# Altium project teclado.PrjPcb (part 2 of 3)
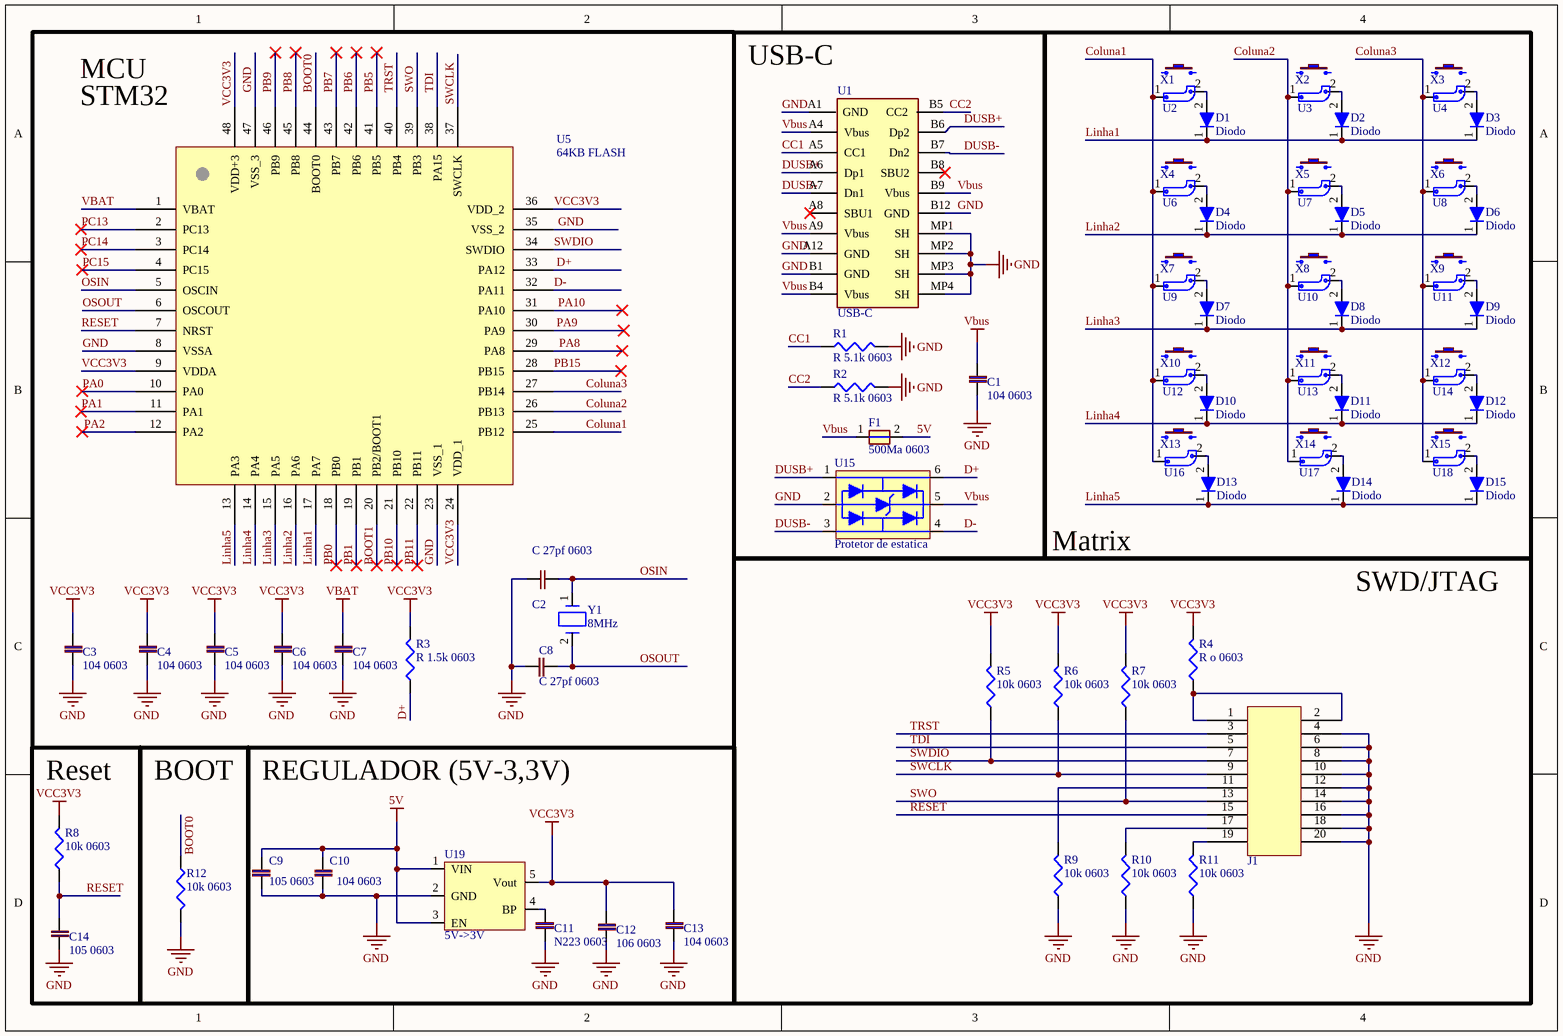
[diagram p1: SqTeclado.SchDoc]

## Sheet SqTeclado.SchDoc (continued)
### Library data of the parts
C1 C3-C7 C10 C13 = CC0603KRX7R7BB104: 16V 100nF X7R ±10% 0603 Multilayer Ceramic Capacitors MLCC - SMD/SMT ROHS; Manufacturer: Yageo Group; Insulation Resistance: 100GΩ; Supplier: DigiKey; Supplier Part Number: 311-1088-1-ND; Manufacturer Part Number: CC0603KRX7R7BB104; RoHS: Compliant; Category: Ceramic Capacitors; Stock: 6931735; Pricing: 1=0,08, 10=0,008, 50=0,0076, 100=0,0072, 500=0,00602 (USD); Value: 100nF; Case/Package: 0603; Case Code (Imperial): 0603; Case Code (Metric): 1608; China RoHS: Compliant; Composition: Ceramic; Depth: 800µm; Dielectric: X7R; Dielectric Material: Ceramic; Halogen Free: Halogen Free; Height: 800µm; Lead Free: Lead Free; Length: 1.6mm; Lifecycle Status: Production; Material: Ceramic; Max Operating Temperature: 125°C; Min Operating Temperature: -55°C; Mounting Technology: Surface Mount; Pins: 2; Number of Terminals: 2; Radiation Hardening: No; REACH SVHC: Yes; Schedule B: 8532240020, 8532240020|8532240020, 8532240020|8532240020|8532240020, 8532240020|8532240020|8532240020|8532240020; Termination: SMD/SMT; Thickness: 889µm; Tolerance: 10%; Voltage: 16V; Voltage Rating: 16V; Voltage Rating (DC): 16V; Width: 800µm; ComponentLink1URL: https://datasheet.octopart.com:443/CC0603KRX7R7BB104-Yageo-datasheet-177165144.pdf?src-supplier=IHS; ComponentLink1Description: https://datasheet.octopart.com:443/CC0603KRX7R7BB104-Yageo-datasheet-177165144.pdf?src-supplier=IHS; ComponentLink2URL: https://datasheet.octopart.com:443/CC0603KRX7R7BB104-Yageo-datasheet-82288757.pdf?src-supplier=Upverter; ComponentLink2Description: https://datasheet.octopart.com:443/CC0603KRX7R7BB104-Yageo-datasheet-82288757.pdf?src-supplier=Upverter; ComponentLink3URL: https://datasheet.octopart.com:443/CC0603KRX7R7BB104-Yageo-datasheet-182050803.pdf?src-supplier=Newark; ComponentLink3Description: https://datasheet.octopart.com:443/CC0603KRX7R7BB104-Yageo-datasheet-182050803.pdf?src-supplier=Newark; ComponentLink4URL: https://datasheet.octopart.com:443/CC0603KRX7R7BB104-Yageo-datasheet-181968638.pdf?src-supplier=Newark; ComponentLink4Description: https://datasheet.octopart.com:443/CC0603KRX7R7BB104-Yageo-datasheet-181968638.pdf?src-supplier=Newark; ComponentLink5URL: https://datasheet.octopart.com:443/CC0603KRX7R7BB104-Phycomp-datasheet-499490.pdf?src-supplier=Newark; ComponentLink5Description: https://datasheet.octopart.com:443/CC0603KRX7R7BB104-Phycomp-datasheet-499490.pdf?src-supplier=Newark; ComponentLink6URL: https://datasheet.octopart.com:443/CC0603KRX7R7BB104-Yageo-datasheet-62336348.pdf?src-supplier=Newark; ComponentLink6Description: https://datasheet.octopart.com:443/CC0603KRX7R7BB104-Yageo-datasheet-62336348.pdf?src-supplier=Newark; ComponentLink7URL: https://datasheet.octopart.com:443/CC0603KRX7R7BB104-Yageo-datasheet-15895757.pdf?src-supplier=Newark; ComponentLink7Description: https://datasheet.octopart.com:443/CC0603KRX7R7BB104-Yageo-datasheet-15895757.pdf?src-supplier=Newark; ComponentLink8URL: https://datasheet.octopart.com/CC0603KRX7R7BB104-Yageo-datasheet-10883670.pdf; ComponentLink8Description: https://datasheet.octopart.com/CC0603KRX7R7BB104-Yageo-datasheet-10883670.pdf; ComponentLink9URL: https://datasheet.octopart.com/CC0603KRX7R7BB104-Yageo-datasheet-12526321.pdf; ComponentLink9Description: https://datasheet.octopart.com/CC0603KRX7R7BB104-Yageo-datasheet-12526321.pdf; ComponentLink10URL: https://datasheet.octopart.com:443/CC0603KRX7R7BB104-Yageo-datasheet-151948686.pdf?src-supplier=Farnell; ComponentLink10Description: https://datasheet.octopart.com:443/CC0603KRX7R7BB104-Yageo-datasheet-151948686.pdf?src-supplier=Farnell; ComponentLink11URL: https://datasheet.octopart.com:443/CC0603KRX7R7BB104-Phycomp-datasheet-500777.pdf?src-supplier=Farnell; ComponentLink11Description: https://datasheet.octopart.com:443/CC0603KRX7R7BB104-Phycomp-datasheet-500777.pdf?src-supplier=Farnell; ComponentLink12URL: https://datasheet.octopart.com:443/CC0603KRX7R7BB104-Phycomp-datasheet-519481.pdf?src-supplier=element14; ComponentLink12Description: https://datasheet.octopart.com:443/CC0603KRX7R7BB104-Phycomp-datasheet-519481.pdf?src-supplier=element14; ComponentLink13URL: https://datasheet.octopart.com:443/CC0603KRX7R7BB104-Yageo-datasheet-8701427.pdf?src-supplier=element14; ComponentLink13Description: https://datasheet.octopart.com:443/CC0603KRX7R7BB104-Yageo-datasheet-8701427.pdf?src-supplier=element14; ComponentLink14URL: https://datasheet.octopart.com:443/CC0603KRX7R7BB104-Yageo-datasheet-5301394.pdf?src-supplier=element14; ComponentLink14Description: https://datasheet.octopart.com:443/CC0603KRX7R7BB104-Yageo-datasheet-5301394.pdf?src-supplier=element14; ComponentLink15URL: https://datasheet.octopart.com:443/CC0603KRX7R7BB104-Yageo-datasheet-166511530.pdf?src-supplier=Future+Electronics; ComponentLink15Description: https://datasheet.octopart.com:443/CC0603KRX7R7BB104-Yageo-datasheet-166511530.pdf?src-supplier=Future+Electronics; ComponentLink16URL: https://datasheet.octopart.com:443/CC0603KRX7R7BB104-Yageo-datasheet-137700082.pdf?src-supplier=Future+Electronics; ComponentLink16Description: https://datasheet.octopart.com:443/CC0603KRX7R7BB104-Yageo-datasheet-137700082.pdf?src-supplier=Future+Electronics; ComponentLink17URL: https://datasheet.octopart.com:443/CC0603KRX7R7BB104-Yageo-datasheet-137700084.pdf?src-supplier=Future+Electronics; ComponentLink17Description: https://datasheet.octopart.com:443/CC0603KRX7R7BB104-Yageo-datasheet-137700084.pdf?src-supplier=Future+Electronics; ComponentLink18URL: https://datasheet.octopart.com:443/CC0603KRX7R7BB104-Yageo-datasheet-27626582.pdf?src-supplier=Future+Electronics; ComponentLink18Description: https://datasheet.octopart.com:443/CC0603KRX7R7BB104-Yageo-datasheet-27626582.pdf?src-supplier=Future+Electronics; ComponentLink19URL: https://datasheet.octopart.com:443/CC0603KRX7R7BB104-Yageo-datasheet-10911834.pdf?src-supplier=Future+Electronics; ComponentLink19Description: https://datasheet.octopart.com:443/CC0603KRX7R7BB104-Yageo-datasheet-10911834.pdf?src-supplier=Future+Electronics; ComponentLink20URL: https://datasheet.octopart.com:443/CC0603KRX7R7BB104-Yageo-datasheet-8324442.pdf?src-supplier=Future+Electronics; ComponentLink20Description: https://datasheet.octopart.com:443/CC0603KRX7R7BB104-Yageo-datasheet-8324442.pdf?src-supplier=Future+Electronics; ComponentLink21URL: https://datasheet.octopart.com:443/CC0603KRX7R7BB104-Yageo-Group-datasheet-165992755.pdf?src-supplier=ODG+(Origin+Data+Global); ComponentLink21Description: https://datasheet.octopart.com:443/CC0603KRX7R7BB104-Yageo-Group-datasheet-165992755.pdf?src-supplier=ODG+(Origin+Data+Global); ComponentLink22URL: https://datasheet.octopart.com:443/CC0603KRX7R7BB104-Yageo-datasheet-140260305.pdf?src-supplier=SOS+electronic; ComponentLink22Description: https://datasheet.octopart.com:443/CC0603KRX7R7BB104-Yageo-datasheet-140260305.pdf?src-supplier=SOS+electronic; ComponentLink23URL: https://datasheet.octopart.com:443/CC0603KRX7R7BB104-Yageo-datasheet-178018956.pdf?src-supplier=Burklin+Elektronik; ComponentLink23Description: https://datasheet.octopart.com:443/CC0603KRX7R7BB104-Yageo-datasheet-178018956.pdf?src-supplier=Burklin+Elektronik; ComponentLink24URL: https://datasheet.octopart.com:443/CC0603KRX7R7BB104-Yageo-datasheet-17600895.pdf?src-supplier=TME; ComponentLink24Description: https://datasheet.octopart.com:443/CC0603KRX7R7BB104-Yageo-datasheet-17600895.pdf?src-supplier=TME; ComponentLink25URL: https://datasheet.octopart.com:443/CC0603KRX7R7BB104-Yageo-datasheet-118396.pdf?src-supplier=DigiKey; ComponentLink25Description: https://datasheet.octopart.com:443/CC0603KRX7R7BB104-Yageo-datasheet-118396.pdf?src-supplier=DigiKey; ComponentLink26URL: http://sigma.octopart.com:80/rohs_statement/Surface-Mount-Ceramic-Multilayer-Capacitors%3B-General-Purpose-%26-High-Capacitance-Class-2%2C-X7R-Yageo-family-124.pdf?src-supplier=Compliance+Statements; ComponentLink26Description: http://sigma.octopart.com:80/rohs_statement/Surface-Mount-Ceramic-Multilayer-Capacitors%3B-General-Purpose-%26-High-Capacitance-Class-2%2C-X7R-Yageo-family-124.pdf?src-supplier=Compliance+Statements; ComponentLink27URL: http://sigma.octopart.com:80/reach_statement/Surface-Mount-Ceramic-Multilayer-Capacitors%3B-General-Purpose-%26-High-Capacitance-Class-2%2C-X7R-Yageo-family-125.pdf?src-supplier=Compliance+Statements; ComponentLink27Description: http://sigma.octopart.com:80/reach_statement/Surface-Mount-Ceramic-Multilayer-Capacitors%3B-General-Purpose-%26-High-Capacitance-Class-2%2C-X7R-Yageo-family-125.pdf?src-supplier=Compliance+Statements; ComponentLink28URL: http://sigma.octopart.com:80/conflict_mineral_statement/Yageo-company-3.pdf?src-supplier=Compliance+Statements; ComponentLink28Description: http://sigma.octopart.com:80/conflict_mineral_statement/Yageo-company-3.pdf?src-supplier=Compliance+Statements; ComponentLink29URL: http://sigma.octopart.com:80/rohs_statement/Yageo-company-2.pdf?src-supplier=Compliance+Statements; ComponentLink29Description: http://sigma.octopart.com:80/rohs_statement/Yageo-company-2.pdf?src-supplier=Compliance+Statements
C2 C8 = CC0603FRNPO9BN270: 0603 27 pF 50 V ±1 % Tolerance NP0 SMT Multilayer Ceramic Capacitor; Manufacturer: Yageo Group; Dielectric: C0G; Insulation Resistance: 10GΩ; Tolerance: 1%; Voltage: 50V; Supplier: DigiKey; Supplier Part Number: 311-3892-1-ND; Manufacturer Part Number: CC0603FRNPO9BN270; RoHS: Compliant; Category: Ceramic Capacitors; Stock: 26604; Pricing: 1=0,15, 10=0,086, 50=0,0606, 100=0,0527, 500=0,03964, 1000=0,03562 (USD); Value: 27pF; Case/Package: 0603; Case Code (Imperial): 0603; Case Code (Metric): 1608; China RoHS: Compliant; Composition: Ceramic; Depth: 800µm; Dielectric Material: Ceramic; Halogen Free: Halogen Free; Height: 800µm; Lead Free: Lead Free; Length: 1.6mm; Lifecycle Status: Production; Max Operating Temperature: 125°C; Min Operating Temperature: -55°C; Mounting Technology: Surface Mount; Number of Terminals: 2; Packaging: Tape and Reel; Radiation Hardening: No; REACH SVHC: Yes; Schedule B: 8532240020, 8532240020|8532240020|8532240020|8532240020|8532240020; Termination: SMD/SMT; Thickness: 889µm; Voltage Rating: 50V; Voltage Rating (DC): 50V; Width: 800µm; ComponentLink1URL: https://datasheet.octopart.com:443/CC0603FRNPO9BN270-Yageo-datasheet-182140217.pdf?src-supplier=IHS; ComponentLink1Description: https://datasheet.octopart.com:443/CC0603FRNPO9BN270-Yageo-datasheet-182140217.pdf?src-supplier=IHS; ComponentLink2URL: https://datasheet.octopart.com:443/CC0603FRNPO9BN270-Yageo-datasheet-151948684.pdf?src-supplier=JRH+Electronics; ComponentLink2Description: https://datasheet.octopart.com:443/CC0603FRNPO9BN270-Yageo-datasheet-151948684.pdf?src-supplier=JRH+Electronics; ComponentLink3URL: https://datasheet.octopart.com:443/CC0603FRNPO9BN270-Yageo-datasheet-181967889.pdf?src-supplier=Farnell; ComponentLink3Description: https://datasheet.octopart.com:443/CC0603FRNPO9BN270-Yageo-datasheet-181967889.pdf?src-supplier=Farnell; ComponentLink4URL: https://datasheet.octopart.com:443/CC0603FRNPO9BN270-Yageo-datasheet-137875056.pdf?src-supplier=Future+Electronics; ComponentLink4Description: https://datasheet.octopart.com:443/CC0603FRNPO9BN270-Yageo-datasheet-137875056.pdf?src-supplier=Future+Electronics; ComponentLink5URL: https://datasheet.octopart.com:443/CC0603FRNPO9BN270-Yageo-datasheet-136957424.pdf?src-supplier=Future+Electronics; ComponentLink5Description: https://datasheet.octopart.com:443/CC0603FRNPO9BN270-Yageo-datasheet-136957424.pdf?src-supplier=Future+Electronics; ComponentLink6URL: https://datasheet.octopart.com:443/CC0603FRNPO9BN270-Yageo-datasheet-137700082.pdf?src-supplier=Future+Electronics; ComponentLink6Description: https://datasheet.octopart.com:443/CC0603FRNPO9BN270-Yageo-datasheet-137700082.pdf?src-supplier=Future+Electronics; ComponentLink7URL: https://datasheet.octopart.com:443/CC0603FRNPO9BN270-Yageo-datasheet-78855684.pdf?src-supplier=Future+Electronics; ComponentLink7Description: https://datasheet.octopart.com:443/CC0603FRNPO9BN270-Yageo-datasheet-78855684.pdf?src-supplier=Future+Electronics; ComponentLink8URL: https://datasheet.octopart.com:443/CC0603FRNPO9BN270-Yageo-datasheet-16730043.pdf?src-supplier=Future+Electronics; ComponentLink8Description: https://datasheet.octopart.com:443/CC0603FRNPO9BN270-Yageo-datasheet-16730043.pdf?src-supplier=Future+Electronics; ComponentLink9URL: https://datasheet.octopart.com:443/CC0603FRNPO9BN270-Yageo-datasheet-12589826.pdf?src-supplier=Future+Electronics; ComponentLink9Description: https://datasheet.octopart.com:443/CC0603FRNPO9BN270-Yageo-datasheet-12589826.pdf?src-supplier=Future+Electronics; ComponentLink10URL: https://datasheet.octopart.com:443/CC0603FRNPO9BN270-Yageo-datasheet-10406438.pdf?src-supplier=Future+Electronics; ComponentLink10Description: https://datasheet.octopart.com:443/CC0603FRNPO9BN270-Yageo-datasheet-10406438.pdf?src-supplier=Future+Electronics; ComponentLink11URL: https://datasheet.octopart.com:443/CC0603FRNPO9BN270-Yageo-datasheet-8817079.pdf?src-supplier=Future+Electronics; ComponentLink11Description: https://datasheet.octopart.com:443/CC0603FRNPO9BN270-Yageo-datasheet-8817079.pdf?src-supplier=Future+Electronics; ComponentLink12URL: https://datasheet.octopart.com:443/CC0603FRNPO9BN270-Yageo-datasheet-8324240.pdf?src-supplier=Future+Electronics; ComponentLink12Description: https://datasheet.octopart.com:443/CC0603FRNPO9BN270-Yageo-datasheet-8324240.pdf?src-supplier=Future+Electronics; ComponentLink13URL: https://datasheet.octopart.com:443/CC0603FRNPO9BN270-Yageo-datasheet-504625.pdf?src-supplier=Future+Electronics; ComponentLink13Description: https://datasheet.octopart.com:443/CC0603FRNPO9BN270-Yageo-datasheet-504625.pdf?src-supplier=Future+Electronics; ComponentLink14URL: https://datasheet.octopart.com:443/CC0603FRNPO9BN270-Yageo-datasheet-5321569.pdf?src-supplier=Future+Electronics; ComponentLink14Description: https://datasheet.octopart.com:443/CC0603FRNPO9BN270-Yageo-datasheet-5321569.pdf?src-supplier=Future+Electronics; ComponentLink15URL: http://sigma.octopart.com:80/conflict_mineral_statement/Yageo-company-3.pdf?src-supplier=Compliance+Statements; ComponentLink15Description: http://sigma.octopart.com:80/conflict_mineral_statement/Yageo-company-3.pdf?src-supplier=Compliance+Statements; ComponentLink16URL: http://sigma.octopart.com:80/rohs_statement/Yageo-company-2.pdf?src-supplier=Compliance+Statements; ComponentLink16Description: http://sigma.octopart.com:80/rohs_statement/Yageo-company-2.pdf?src-supplier=Compliance+Statements
C9 C14 = CL10B105KP8NNNC: 10V 1uF X7R ±10% 0603 Multilayer Ceramic Capacitors MLCC - SMD/SMT ROHS; Manufacturer: Samsung Electro-Mechanics; Value: 1µF; Supplier: DigiKey; Supplier Part Number: 1276-1946-1-ND; Manufacturer Part Number: CL10B105KP8NNNC; RoHS: Compliant; Category: Ceramic Capacitors; Stock: 4700118; Pricing: 1=0,08, 10=0,005 (USD); Case/Package: 0603; Case Code (Imperial): 0603; Case Code (Metric): 1608; China RoHS: Compliant; Contact Plating: Tin; Depth: 800µm; Dielectric: X7R; Dielectric Material: Ceramic; Height: 900µm; Lead Free: Lead Free; Length: 1.6mm; Lifecycle Status: Production; Material: Ceramic; Max Operating Temperature: 125°C; Min Operating Temperature: -55°C; Mounting Technology: Surface Mount; Number of Terminals: 2; Radiation Hardening: No; REACH SVHC: Yes; Schedule B: 8532240020, 8532240020|8532240020, 8532240020|8532240020|8532240020, 8532240020|8532240020|8532240020|8532240020; Thickness: 889µm; Tolerance: 10%; Voltage Rating: 10V; Voltage Rating (DC): 10V; Width: 800µm; ComponentLink1URL: https://datasheet.octopart.com:443/CL10B105KP8NNNC-Samsung-Electro-Mechanics-datasheet-136482318.pdf?src-supplier=IHS; ComponentLink1Description: https://datasheet.octopart.com:443/CL10B105KP8NNNC-Samsung-Electro-Mechanics-datasheet-136482318.pdf?src-supplier=IHS; ComponentLink2URL: https://datasheet.octopart.com:443/CL10B105KP8NNNC-Samsung-Electro-Mechanics-datasheet-116051279.pdf?src-supplier=Future+Electronics; ComponentLink2Description: https://datasheet.octopart.com:443/CL10B105KP8NNNC-Samsung-Electro-Mechanics-datasheet-116051279.pdf?src-supplier=Future+Electronics; ComponentLink3URL: https://datasheet.octopart.com:443/CL10B105KP8NNNC-Samsung-Electro-Mechanics-datasheet-81461854.pdf?src-supplier=Future+Electronics; ComponentLink3Description: https://datasheet.octopart.com:443/CL10B105KP8NNNC-Samsung-Electro-Mechanics-datasheet-81461854.pdf?src-supplier=Future+Electronics; ComponentLink4URL: https://datasheet.octopart.com:443/CL10B105KP8NNNC-Samsung-datasheet-13325309.pdf?src-supplier=Future+Electronics; ComponentLink4Description: https://datasheet.octopart.com:443/CL10B105KP8NNNC-Samsung-datasheet-13325309.pdf?src-supplier=Future+Electronics; ComponentLink5URL: https://datasheet.octopart.com:443/CL10B105KP8NNNC-Samsung-datasheet-26669024.pdf?src-supplier=Future+Electronics; ComponentLink5Description: https://datasheet.octopart.com:443/CL10B105KP8NNNC-Samsung-datasheet-26669024.pdf?src-supplier=Future+Electronics; ComponentLink6URL: https://datasheet.octopart.com:443/CL10B105KP8NNNC-Samsung-Electro-Mechanics-datasheet-149136800.pdf?src-supplier=Future+Electronics; ComponentLink6Description: https://datasheet.octopart.com:443/CL10B105KP8NNNC-Samsung-Electro-Mechanics-datasheet-149136800.pdf?src-supplier=Future+Electronics; ComponentLink7URL: https://datasheet.octopart.com:443/CL10B105KP8NNNC-Samsung-datasheet-37081328.pdf?src-supplier=Future+Electronics; ComponentLink7Description: https://datasheet.octopart.com:443/CL10B105KP8NNNC-Samsung-datasheet-37081328.pdf?src-supplier=Future+Electronics; ComponentLink8URL: https://datasheet.octopart.com/CL10B105KP8NNNC-Samsung-Electro-Mechanics-datasheet-97040617.pdf; ComponentLink8Description: https://datasheet.octopart.com/CL10B105KP8NNNC-Samsung-Electro-Mechanics-datasheet-97040617.pdf; ComponentLink9URL: https://datasheet.octopart.com/CL10B105KP8NNNC-Samsung-Electro-Mechanics-datasheet-8324245.pdf; ComponentLink9Description: https://datasheet.octopart.com/CL10B105KP8NNNC-Samsung-Electro-Mechanics-datasheet-8324245.pdf; ComponentLink10URL: https://datasheet.octopart.com:443/CL10B105KP8NNNC-Samsung-Electro-Mechanics-datasheet-11881110.pdf?src-supplier=Arrow+Electronics; ComponentLink10Description: https://datasheet.octopart.com:443/CL10B105KP8NNNC-Samsung-Electro-Mechanics-datasheet-11881110.pdf?src-supplier=Arrow+Electronics; ComponentLink11URL: https://datasheet.octopart.com:443/CL10B105KP8NNNC-Samsung-datasheet-59220082.pdf?src-supplier=TME; ComponentLink11Description: https://datasheet.octopart.com:443/CL10B105KP8NNNC-Samsung-datasheet-59220082.pdf?src-supplier=TME
C11 = CL10B223KB8WPNC: Ceramic Capacitor, Multilayer, Ceramic, 50V, 10% +Tol, 10% -Tol, X7R, +-15% TC, 22nF, Surface Mount, 0603 inch; Manufacturer: Samsung Electro-Mechanics; Supplier: DigiKey; Supplier Part Number: 1276-6534-1-ND; Manufacturer Part Number: CL10B223KB8WPNC; RoHS: Compliant; Category: Ceramic Capacitors; Stock: 843417; Pricing: 1=0,1, 10=0,041, 50=0,028, 100=0,024, 500=0,01736, 1000=0,01532 (USD); Value: 22nF; Case/Package: 0603; Case Code (Imperial): 0603; Case Code (Metric): 1608; China RoHS: Compliant; Dielectric Material: Ceramic; Features: Soft Termination; Height: 900µm; Length: 1.6002mm; Lifecycle Status: Production; Material: Ceramic; Max Operating Temperature: 125°C; Min Operating Temperature: -55°C; Mounting Technology: Surface Mount; Number of Terminals: 2; Packaging: Cut Tape (CT); Ratings: AEC-Q200; REACH SVHC: Yes; Thickness: 889µm; Tolerance: 10%; Voltage Rating: 50V; Voltage Rating (DC): 50V; Width: 787.4µm; ComponentLink1URL: https://datasheet.octopart.com:443/CL10B223KB8WPNC-Samsung-Electro-Mechanics-datasheet-176142735.pdf?src-supplier=Farnell; ComponentLink1Description: https://datasheet.octopart.com:443/CL10B223KB8WPNC-Samsung-Electro-Mechanics-datasheet-176142735.pdf?src-supplier=Farnell; ComponentLink2URL: https://datasheet.octopart.com:443/CL10B223KB8WPNC-Samsung-Electro-Mechanics-datasheet-140815180.pdf?src-supplier=Farnell; ComponentLink2Description: https://datasheet.octopart.com:443/CL10B223KB8WPNC-Samsung-Electro-Mechanics-datasheet-140815180.pdf?src-supplier=Farnell; ComponentLink3URL: https://datasheet.octopart.com:443/CL10B223KB8WPNC-Samsung-Electro-Mechanics-datasheet-141347181.pdf?src-supplier=Samsung+SCT; ComponentLink3Description: https://datasheet.octopart.com:443/CL10B223KB8WPNC-Samsung-Electro-Mechanics-datasheet-141347181.pdf?src-supplier=Samsung+SCT; ComponentLink4URL: https://datasheet.octopart.com:443/CL10B223KB8WPNC-Samsung-datasheet-8326407.pdf?src-supplier=TME; ComponentLink4Description: https://datasheet.octopart.com:443/CL10B223KB8WPNC-Samsung-datasheet-8326407.pdf?src-supplier=TME; ComponentLink5URL: https://datasheet.octopart.com:443/CL10B223KB8WPNC-Samsung-Electro-Mechanics-datasheet-149136823.pdf?src-supplier=Future+Electronics; ComponentLink5Description: https://datasheet.octopart.com:443/CL10B223KB8WPNC-Samsung-Electro-Mechanics-datasheet-149136823.pdf?src-supplier=Future+Electronics
C12 = LMK107BBJ106MALT: Multilayer Ceramic Capacitors (High dielectric type), 10V, 10 uF, ± 20 %, 0603, X5R, RoHS; Manufacturer: Taiyo Yuden; Value: 10µF; Tolerance: 20%; Supplier: DigiKey; Supplier Part Number: 587-3258-1-ND; Manufacturer Part Number: LMK107BBJ106MALT; RoHS: Compliant; Category: Ceramic Capacitors; Stock: 1593340; Pricing: 1=0,08, 10=0,046, 50=0,036, 100=0,0256, 500=0,0212, 1000=0,01928 (USD); Case/Package: 0603; Case Code (Imperial): 0603; Case Code (Metric): 1608; Composition: Ceramic; Depth: 800µm; Dielectric: X5R; Dielectric Material: Ceramic; Height: 800µm; Lead Free: Lead Free; Length: 1.6mm; Lifecycle Status: Production; Material: Ceramic; Max Operating Temperature: 85°C; Min Operating Temperature: -55°C; Mounting Technology: Surface Mount; Number of Terminals: 2; Radiation Hardening: No; REACH SVHC: Yes; Termination: SMD/SMT; Thickness: 889µm; Voltage: 10V; Voltage Rating: 10V; Voltage Rating (DC): 10V; Width: 800µm; ComponentLink1URL: https://datasheet.octopart.com:443/LMK107BBJ106MALT-Taiyo-Yuden-datasheet-182109547.pdf?src-supplier=IHS; ComponentLink1Description: https://datasheet.octopart.com:443/LMK107BBJ106MALT-Taiyo-Yuden-datasheet-182109547.pdf?src-supplier=IHS; ComponentLink2URL: https://datasheet.octopart.com:443/LMK107BBJ106MALT-Taiyo-Yuden-datasheet-151625811.pdf?src-supplier=element14+APAC; ComponentLink2Description: https://datasheet.octopart.com:443/LMK107BBJ106MALT-Taiyo-Yuden-datasheet-151625811.pdf?src-supplier=element14+APAC; ComponentLink3URL: https://datasheet.octopart.com:443/LMK107BBJ106MALT-Taiyo-Yuden-datasheet-21408036.pdf?src-supplier=element14+APAC; ComponentLink3Description: https://datasheet.octopart.com:443/LMK107BBJ106MALT-Taiyo-Yuden-datasheet-21408036.pdf?src-supplier=element14+APAC; ComponentLink4URL: https://datasheet.octopart.com:443/LMK107BBJ106MALT-Taiyo-Yuden-datasheet-41194858.pdf?src-supplier=Newark; ComponentLink4Description: https://datasheet.octopart.com:443/LMK107BBJ106MALT-Taiyo-Yuden-datasheet-41194858.pdf?src-supplier=Newark; ComponentLink5URL: https://datasheet.octopart.com:443/LMK107BBJ106MALT-Taiyo-Yuden-datasheet-8857305.pdf?src-supplier=Newark; ComponentLink5Description: https://datasheet.octopart.com:443/LMK107BBJ106MALT-Taiyo-Yuden-datasheet-8857305.pdf?src-supplier=Newark; ComponentLink6URL: https://datasheet.octopart.com:443/LMK107BBJ106MALT-Taiyo-Yuden-datasheet-8434558.pdf?src-supplier=Newark; ComponentLink6Description: https://datasheet.octopart.com:443/LMK107BBJ106MALT-Taiyo-Yuden-datasheet-8434558.pdf?src-supplier=Newark; ComponentLink7URL: https://datasheet.octopart.com:443/LMK107BBJ106MALT-Taiyo-Yuden-datasheet-154807907.pdf?src-supplier=Master+Electronics; ComponentLink7Description: https://datasheet.octopart.com:443/LMK107BBJ106MALT-Taiyo-Yuden-datasheet-154807907.pdf?src-supplier=Master+Electronics; ComponentLink8URL: https://datasheet.octopart.com:443/LMK107BBJ106MALT-Taiyo-Yuden-datasheet-140424376.pdf?src-supplier=Master+Electronics; ComponentLink8Description: https://datasheet.octopart.com:443/LMK107BBJ106MALT-Taiyo-Yuden-datasheet-140424376.pdf?src-supplier=Master+Electronics; ComponentLink9URL: https://datasheet.octopart.com:443/LMK107BBJ106MALT-Taiyo-Yuden-datasheet-10851928.pdf?src-supplier=Future+Electronics; ComponentLink9Description: https://datasheet.octopart.com:443/LMK107BBJ106MALT-Taiyo-Yuden-datasheet-10851928.pdf?src-supplier=Future+Electronics; ComponentLink10URL: https://datasheet.octopart.com:443/LMK107BBJ106MALT-Taiyo-Yuden-datasheet-100443364.pdf?src-supplier=Future+Electronics; ComponentLink10Description: https://datasheet.octopart.com:443/LMK107BBJ106MALT-Taiyo-Yuden-datasheet-100443364.pdf?src-supplier=Future+Electronics; ComponentLink11URL: https://datasheet.octopart.com:443/LMK107BBJ106MALT-Taiyo-Yuden-datasheet-99833423.pdf?src-supplier=Future+Electronics; ComponentLink11Description: https://datasheet.octopart.com:443/LMK107BBJ106MALT-Taiyo-Yuden-datasheet-99833423.pdf?src-supplier=Future+Electronics; ComponentLink12URL: https://datasheet.octopart.com:443/LMK107BBJ106MALT-Taiyo-Yuden-datasheet-99833418.pdf?src-supplier=Future+Electronics; ComponentLink12Description: https://datasheet.octopart.com:443/LMK107BBJ106MALT-Taiyo-Yuden-datasheet-99833418.pdf?src-supplier=Future+Electronics; ComponentLink13URL: https://datasheet.octopart.com:443/LMK107BBJ106MALT-Taiyo-Yuden-datasheet-138738940.pdf?src-supplier=Taiyo+Yuden+SCT; ComponentLink13Description: https://datasheet.octopart.com:443/LMK107BBJ106MALT-Taiyo-Yuden-datasheet-138738940.pdf?src-supplier=Taiyo+Yuden+SCT
D1-D15 = RB751V40T1G: Rectifier Diode Schottky 40V 0.03A 2-Pin SOD-323 T/R / DIODE SCHOTTKY 30V 30MA SOD323; Manufacturer: onsemi; Manufacturer Lifecycle Status: ACTIVE; Value: 2pF; Element Configuration: Single; Forward Voltage: 370mV; Max Forward Surge Current (Ifsm): 500mA; Max Junction Temperature (Tj): 150°C; Max Power Dissipation: 200mW; Max Reverse Leakage Current: 500nA; Number of Elements: 1; Peak Reverse Current: 300nA; Polarity: Standard; Supplier: DigiKey; Supplier Part Number: RB751V40T1GOSCT-ND; Manufacturer Part Number: RB751V40T1G; RoHS: Compliant; Category: Schottky Diodes; Stock: 326738; Pricing: 1=0,12, 10=0,08, 100=0,0663, 500=0,0482, 1000=0,04232 (USD); Average Rectified Current: 30mA; China RoHS: Compliant; Current Rating: 30mA; Forward Current: 30mA; Height: 1.1mm; Lead Free: Lead Free; Length: 1.7mm; Lifecycle Status: Production; Max Operating Temperature: 150°C; Max Output current: 30mA; Max Repetitive Reverse Voltage (Vrrm): 40V; Max Reverse Voltage (DC): 30V; Max Surge Current: 500mA; Min Operating Temperature: -55°C; Pins: 2; Number of Terminals: 2; Output Current: 30mA; Packaging: Tape and Reel; Peak Non-Repetitive Surge Current: 500mA; Power Dissipation: 200mW; Radiation Hardening: No; REACH SVHC: Yes; Reverse Standoff Voltage: 40V; Reverse Voltage: 30V; Schedule B: 8541100070, 8541100070|8541100070|8541100070|8541100070|8541100070; Voltage Rating (DC): 40V; Width: 1.25mm; ComponentLink1URL: https://datasheet.octopart.com:443/RB751V40T1G-ON-Semiconductor-datasheet-41194509.pdf?src-supplier=Newark; ComponentLink1Description: https://datasheet.octopart.com:443/RB751V40T1G-ON-Semiconductor-datasheet-41194509.pdf?src-supplier=Newark; ComponentLink2URL: https://datasheet.octopart.com:443/RB751V40T1G-onsemi-datasheet-181959519.pdf?src-supplier=Newark; ComponentLink2Description: https://datasheet.octopart.com:443/RB751V40T1G-onsemi-datasheet-181959519.pdf?src-supplier=Newark; ComponentLink3URL: https://datasheet.octopart.com:443/RB751V40T1G-onsemi-datasheet-180967452.pdf?src-supplier=IHS; ComponentLink3Description: https://datasheet.octopart.com:443/RB751V40T1G-onsemi-datasheet-180967452.pdf?src-supplier=IHS; ComponentLink4URL: https://datasheet.octopart.com:443/RB751V40T1G-ON-Semiconductor-datasheet-7840961.pdf?src-supplier=onsemi; ComponentLink4Description: https://datasheet.octopart.com:443/RB751V40T1G-ON-Semiconductor-datasheet-7840961.pdf?src-supplier=onsemi; ComponentLink5URL: https://sigma.octopart.com:443/138897946/technical_drawing/ON-Semiconductor-RB751V40T1G.pdf?src-supplier=Upverter; ComponentLink5Description: https://sigma.octopart.com:443/138897946/technical_drawing/ON-Semiconductor-RB751V40T1G.pdf?src-supplier=Upverter; ComponentLink6URL: https://datasheet.octopart.com:443/RB751V40T1G-onsemi-datasheet-189132549.pdf?src-supplier=Master+Electronics; ComponentLink6Description: https://datasheet.octopart.com:443/RB751V40T1G-onsemi-datasheet-189132549.pdf?src-supplier=Master+Electronics; ComponentLink7URL: https://datasheet.octopart.com:443/RB751V40T1G-ON-Semiconductor-datasheet-14053699.pdf?src-supplier=iiiC; ComponentLink7Description: https://datasheet.octopart.com:443/RB751V40T1G-ON-Semiconductor-datasheet-14053699.pdf?src-supplier=iiiC; ComponentLink8URL: http://sigma.octopart.com:80/150630996/rohs_statement/ON-Semiconductor-RB751V40T1G.pdf?src-supplier=Compliance+Statements; ComponentLink8Description: http://sigma.octopart.com:80/150630996/rohs_statement/ON-Semiconductor-RB751V40T1G.pdf?src-supplier=Compliance+Statements; Breakdown Voltage: 30V; Case/Package: SOD-323-2; Contact Plating: Tin; ComponentLink9URL: http://sigma.octopart.com:80/reach_statement/ON-Semiconductor-company-79.pdf?src-supplier=Compliance+Statements; ComponentLink9Description: http://sigma.octopart.com:80/reach_statement/ON-Semiconductor-company-79.pdf?src-supplier=Compliance+Statements; ComponentLink10URL: https://octopart.com:443/opatz8j6/c1?t=IbneskzpI6_J-0eY_y-X2yn2N-5wLoMr36apzcez1S_u4OvquotVY5BE5fLqyPyiIhjspGfCn1ztEOQs5lUs8YSmcSDpiD0yNsSosKmFxQ2VZB7rFFyzFStaQmehSvuBD_5Fjp87ktPqqQqsOBmyFi_jZJIZCoBdtoiqD19nz4vQSd4pu3K8wIVgp6XFpI-O9H_zLHNefACfV6j-N4H3UJuvVBWUuLqINZc0CV-0fJawZMzDzVmangXZQ_aEOc3DOUx5hrTGhpQjW-fyp_zH5ezkV_H6XXL2FecWA9u7jRraK23ujBpybLeXZZ4QgBKpVYHs8tSA4CrzrXt4hEWg2haxnQGokIBqJFD5CN0&src-supplier=Compliance+Statements; ComponentLink10Description: https://octopart.com:443/opatz8j6/c1?t=IbneskzpI6_J-0eY_y-X2yn2N-5wLoMr36apzcez1S_u4OvquotVY5BE5fLqyPyiIhjspGfCn1ztEOQs5lUs8YSmcSDpiD0yNsSosKmFxQ2VZB7rFFyzFStaQmehSvuBD_5Fjp87ktPqqQqsOBmyFi_jZJIZCoBdtoiqD19nz4vQSd4pu3K8wIVgp6XFpI-O9H_zLHNefACfV6j-N4H3UJuvVBWUuLqINZc0CV-0fJawZMzDzVmangXZQ_aEOc3DOUx5hrTGhpQjW-fyp_zH5ezkV_H6XXL2FecWA9u7jRraK23ujBpybLeXZZ4QgBKpVYHs8tSA4CrzrXt4hEWg2haxnQGokIBqJFD5CN0&src-supplier=Compliance+Statements; ComponentLink11URL: https://octopart.com:443/opatz8j6/c1?t=qIfCs529ldaWZU0ub9LYhnPXHBmDeJdE0JV4wqGLUhnGh5a0BS7kfzUI9zL_JaDXZFykcslYIWxAhQ5X0oh6J8wRLEITjFJB-_qXZnEOzcPmN69_Qugj71XII_8ETcLUyzSs3rzS31vIojbIhgnJ_7XhuEMZJSZPHyPuMFBH_ZzDjM13A6tpbSWNI9CgjC1g_q5wgGJdNwHOPQ_BZxh8Y2CDUgAAWKD7AuUYdFw4kRI0fhiPd9fP-Ll6d45IPzSr4bAloWCduol0C0YJ_9IUZQSygUOMTjgU_wvPI_Jt6ISIRSVcSG3mdm5w8DKmD-PN91fyf4QeSQbgGTAN30a1piGPKkuf8znY58UiFA&src-supplier=Compliance+Statements; ComponentLink11Description: https://octopart.com:443/opatz8j6/c1?t=qIfCs529ldaWZU0ub9LYhnPXHBmDeJdE0JV4wqGLUhnGh5a0BS7kfzUI9zL_JaDXZFykcslYIWxAhQ5X0oh6J8wRLEITjFJB-_qXZnEOzcPmN69_Qugj71XII_8ETcLUyzSs3rzS31vIojbIhgnJ_7XhuEMZJSZPHyPuMFBH_ZzDjM13A6tpbSWNI9CgjC1g_q5wgGJdNwHOPQ_BZxh8Y2CDUgAAWKD7AuUYdFw4kRI0fhiPd9fP-Ll6d45IPzSr4bAloWCduol0C0YJ_9IUZQSygUOMTjgU_wvPI_Jt6ISIRSVcSG3mdm5w8DKmD-PN91fyf4QeSQbgGTAN30a1piGPKkuf8znY58UiFA&src-supplier=Compliance+Statements
F1 = ERB-RE0R50V: Fuse Chip Fast Acting 0.5A 32V SMD Solder Pad 0603 1.6 X 0.8 X 0.54mm T/R UL/cUL; Manufacturer: Panasonic; Manufacturer Lifecycle Status: ACTIVE; Part Series: Micro Chip Fuse; Approvals: UL; Body Material: Alumina; Value: 330mΩ; Supplier: DigiKey; Supplier Part Number: P15127CT-ND; Manufacturer Part Number: ERB-RE0R50V; RoHS: Compliant; Category: Fuses; Stock: 106595; Pricing: 1=0,32, 5=0,262, 10=0,241, 50=0,2, 100=0,1846, 250=0,16596, 500=0,15312, 1000=0,14123 (USD); Case/Package: 0603; Case Code (Imperial): 0603; Case Code (Metric): 1608; Current: 500mA; Current Rating: 500mA; Depth: 800µm; Fuse Current: 500mA; Height: 540µm; Length: 1.6mm; Lifecycle Status: Production; Max Operating Temperature: 125°C; Max Voltage Rating (DC): 32V; Manufacturer Package Identifier: ERB-RE0R50V; Min Operating Temperature: -40°C; Mounting Technology: Surface Mount; Pins: 2; Packaging: Cut Tape; Radiation Hardening: No; REACH SVHC: Yes; Voltage Rating: 32V; Voltage Rating (DC): 32V; Width: 800µm; ComponentLink1URL: https://datasheet.octopart.com:443/ERB-RE0R50V-Panasonic-datasheet-78834729.pdf?src-supplier=Newark; ComponentLink1Description: https://datasheet.octopart.com:443/ERB-RE0R50V-Panasonic-datasheet-78834729.pdf?src-supplier=Newark; ComponentLink2URL: https://datasheet.octopart.com:443/ERB-RE0R50V-Panasonic-datasheet-11844109.pdf?src-supplier=RS+(Formerly+Allied+Electronics); ComponentLink2Description: https://datasheet.octopart.com:443/ERB-RE0R50V-Panasonic-datasheet-11844109.pdf?src-supplier=RS+(Formerly+Allied+Electronics); ComponentLink3URL: https://datasheet.octopart.com:443/ERB-RE0R50V-Panasonic-datasheet-136807619.pdf?src-supplier=Farnell; ComponentLink3Description: https://datasheet.octopart.com:443/ERB-RE0R50V-Panasonic-datasheet-136807619.pdf?src-supplier=Farnell; ComponentLink4URL: https://datasheet.octopart.com:443/ERB-RE0R50V-Panasonic-datasheet-10129016.pdf?src-supplier=element14+APAC; ComponentLink4Description: https://datasheet.octopart.com:443/ERB-RE0R50V-Panasonic-datasheet-10129016.pdf?src-supplier=element14+APAC; ComponentLink5URL: https://datasheet.octopart.com:443/ERB-RE0R50V-Panasonic-datasheet-37173566.pdf?src-supplier=Electro+Sonic; ComponentLink5Description: https://datasheet.octopart.com:443/ERB-RE0R50V-Panasonic-datasheet-37173566.pdf?src-supplier=Electro+Sonic; ComponentLink6URL: https://datasheet.octopart.com:443/ERB-RE0R50V-Panasonic-datasheet-44403852.pdf?src-supplier=Electro+Sonic; ComponentLink6Description: https://datasheet.octopart.com:443/ERB-RE0R50V-Panasonic-datasheet-44403852.pdf?src-supplier=Electro+Sonic
J1 = 70247-2051: Conn Shrouded Header (4 Sides) HDR 20 POS 2.54mm Solder RA Side Entry Thru-HoleC-Grid Tray; Manufacturer: Molex; Manufacturer Lifecycle Status: ACTIVE; Connector Type: Male Pin; Contact Resistance: 20mΩ; Current Rating: 2.5A; Insulation Resistance: 12GΩ; Number of Positions: 20; Gender: Male; Glow Wire Compliant: Non-compliant; Lead Length: 3.05mm; Mating Post Length: 6.1mm; Max Current Rating: 2A; Max Voltage Rating (AC): 125V; Max Voltage Rating (DC): 250V; Number of Circuits: 16; Plating: Tin; Plating Thickness: 381nm; Supplier: DigiKey; Supplier Part Number: 23-0702472051-ND; Manufacturer Part Number: 70247-2051; RoHS: Compliant; Category: Headers and Wire Housings; Stock: 2615; Pricing: 1=3,89, 10=3,305, 100=2,809, 500=2,50744, 1000=2,38782 (USD); Color: Black; Contact Gender: Male; Contact Material: Gold, Nickel; Contact Plating: Gold; Lead Free: Lead Free; Lifecycle Status: Production; Max Operating Temperature: 120°C; Min Operating Temperature: -55°C; Mounting Technology: Surface Mount, Through Hole; Pins: 20; Number of Rows: 2; Pitch: 2.54mm; REACH SVHC: Yes; Row Spacing: 2.54mm; Terminal Pitch: 2.54mm; Termination: Solder; ComponentLink1URL: https://datasheet.octopart.com:443/70247-2051-Molex-datasheet-165345562.pdf?src-supplier=IHS; ComponentLink1Description: https://datasheet.octopart.com:443/70247-2051-Molex-datasheet-165345562.pdf?src-supplier=IHS; ComponentLink2URL: https://datasheet.octopart.com:443/70247-2051-Molex-datasheet-13786369.pdf?src-supplier=Molex; ComponentLink2Description: https://datasheet.octopart.com:443/70247-2051-Molex-datasheet-13786369.pdf?src-supplier=Molex; ComponentLink3URL: https://sigma.octopart.com:443/15650526/technical_drawing/Molex-70247-2051.pdf?src-supplier=Molex; ComponentLink3Description: https://sigma.octopart.com:443/15650526/technical_drawing/Molex-70247-2051.pdf?src-supplier=Molex; China RoHS: Compliant; Contact Mating Length: 6.096mm; Country of Origin: SK; Depth: 6.3mm; ELV: Compliant; Flammability Rating: UL94 V-0; Height: 7.6mm; Housing Color: Black; Housing Material: Polyester; Lead Pitch: 2.54mm; Length: 8.65mm; Material: Polyester; Number of Contacts: 20; Orientation: Right Angle; Radiation Hardening: No; Voltage Rating: 250V; Voltage Rating (DC): 250V; ComponentLink4URL: https://datasheet.octopart.com:443/702472051-Molex-datasheet-8335392.pdf?src-supplier=Verical; ComponentLink4Description: https://datasheet.octopart.com:443/702472051-Molex-datasheet-8335392.pdf?src-supplier=Verical; ComponentLink5URL: https://datasheet.octopart.com:443/70247-2051-Molex-datasheet-154757683.pdf?src-supplier=Master+Electronics; ComponentLink5Description: https://datasheet.octopart.com:443/70247-2051-Molex-datasheet-154757683.pdf?src-supplier=Master+Electronics; ComponentLink6URL: https://datasheet.octopart.com:443/70247-2051-Molex-datasheet-62105721.pdf?src-supplier=Electro+Sonic; ComponentLink6Description: https://datasheet.octopart.com:443/70247-2051-Molex-datasheet-62105721.pdf?src-supplier=Electro+Sonic; ComponentLink7URL: https://datasheet.octopart.com:443/70247-2051-Molex-datasheet-37171976.pdf?src-supplier=Electro+Sonic; ComponentLink7Description: https://datasheet.octopart.com:443/70247-2051-Molex-datasheet-37171976.pdf?src-supplier=Electro+Sonic; ComponentLink8URL: https://datasheet.octopart.com:443/70247-2051-Molex-datasheet-28833383.pdf?src-supplier=Electro+Sonic; ComponentLink8Description: https://datasheet.octopart.com:443/70247-2051-Molex-datasheet-28833383.pdf?src-supplier=Electro+Sonic; ComponentLink9URL: https://datasheet.octopart.com:443/702472051-Molex-datasheet-8221744.pdf?src-supplier=Jameco; ComponentLink9Description: https://datasheet.octopart.com:443/702472051-Molex-datasheet-8221744.pdf?src-supplier=Jameco; ComponentLink10URL: https://datasheet.octopart.com:443/70247-2051-Molex-datasheet-141297.pdf?src-supplier=DigiKey; ComponentLink10Description: https://datasheet.octopart.com:443/70247-2051-Molex-datasheet-141297.pdf?src-supplier=DigiKey; ComponentLink11URL: http://sigma.octopart.com:80/15650546/rohs_certificate/Molex-70247-2051.pdf?src-supplier=Compliance+Statements; ComponentLink11Description: http://sigma.octopart.com:80/15650546/rohs_certificate/Molex-70247-2051.pdf?src-supplier=Compliance+Statements; ComponentLink12URL: http://sigma.octopart.com:80/reach_statement/Molex-company-74.pdf?src-supplier=Compliance+Statements; ComponentLink12Description: http://sigma.octopart.com:80/reach_statement/Molex-company-74.pdf?src-supplier=Compliance+Statements; ComponentLink13URL: http://sigma.octopart.com:80/rohs_statement/Molex-company-73.pdf?src-supplier=Compliance+Statements; ComponentLink13Description: http://sigma.octopart.com:80/rohs_statement/Molex-company-73.pdf?src-supplier=Compliance+Statements; ComponentLink14URL: http://sigma.octopart.com:80/conflict_mineral_statement/Molex-company-72.pdf?src-supplier=Compliance+Statements; ComponentLink14Description: http://sigma.octopart.com:80/conflict_mineral_statement/Molex-company-72.pdf?src-supplier=Compliance+Statements
R1 R2 = RC0603FR-075K1L: Res Thick Film 0603 5.1K Ohm 1% 0.1W(1/10W) ±100ppm/C Pad SMD T/R; Manufacturer: Yageo Group; Max Power Dissipation: 100mW; Value: 5.1kΩ; Temperature Coefficient: 100ppm/°C; Voltage Rating: 75V; Voltage Rating (DC): 50V; Supplier: DigiKey; Supplier Part Number: 311-5.10KHRCT-ND; Manufacturer Part Number: RC0603FR-075K1L; RoHS: Compliant; Category: Chip SMD Resistors; Stock: 641466; Pricing: 1=0,1, 10=0,007, 25=0,0068, 50=0,0062, 100=0,0057 (USD); Case/Package: 0603; Case Code (Imperial): 0603; China RoHS: Non-Compliant; Composition: Thick Film; Depth: 800µm; Features: Moisture Resistant; Height: 450µm; Lead Free: Lead Free; Lifecycle Status: Production; Max Operating Temperature: 155°C; Military Standard: Not; Min Operating Temperature: -55°C; Mounting Technology: Surface Mount; Pins: 2; Number of Terminals: 2; Number of Terminations: 2; Packaging: Tape & Reel; Power Dissipation: 100mW; Power Rating: 100mW; REACH SVHC: Yes; Schedule B: 8533210045, 8533210045|8533210045, 8533210045|8533210045|8533210045, 8533210045|8533210045|8533210045|8533210045; Termination: SMD/SMT; Tolerance: 1%; Width: 800µm; Working Voltage: 75V; ComponentLink1URL: https://datasheet.octopart.com:443/RC0603FR-075K1L-Yageo-datasheet-175887523.pdf?src-supplier=IHS; ComponentLink1Description: https://datasheet.octopart.com:443/RC0603FR-075K1L-Yageo-datasheet-175887523.pdf?src-supplier=IHS; ComponentLink2URL: https://datasheet.octopart.com:443/RC0603FR-075K1L-Yageo-datasheet-103092701.pdf?src-supplier=Upverter; ComponentLink2Description: https://datasheet.octopart.com:443/RC0603FR-075K1L-Yageo-datasheet-103092701.pdf?src-supplier=Upverter; ComponentLink3URL: https://datasheet.octopart.com:443/RC0603FR-075K1L-Yageo-Group-datasheet-190305687.pdf?src-supplier=Newark; ComponentLink3Description: https://datasheet.octopart.com:443/RC0603FR-075K1L-Yageo-Group-datasheet-190305687.pdf?src-supplier=Newark; ComponentLink4URL: https://datasheet.octopart.com:443/RC0603FR-075K1L-Yageo-datasheet-8328172.pdf?src-supplier=Farnell; ComponentLink4Description: https://datasheet.octopart.com:443/RC0603FR-075K1L-Yageo-datasheet-8328172.pdf?src-supplier=Farnell; ComponentLink5URL: https://datasheet.octopart.com:443/RC0603FR-075K1L-Yageo-datasheet-62067350.pdf?src-supplier=Farnell; ComponentLink5Description: https://datasheet.octopart.com:443/RC0603FR-075K1L-Yageo-datasheet-62067350.pdf?src-supplier=Farnell; ComponentLink6URL: https://datasheet.octopart.com:443/RC0603FR-075K1L-Yageo-datasheet-34211833.pdf?src-supplier=element14+APAC; ComponentLink6Description: https://datasheet.octopart.com:443/RC0603FR-075K1L-Yageo-datasheet-34211833.pdf?src-supplier=element14+APAC; ComponentLink7URL: https://datasheet.octopart.com:443/RC0603FR-075K1L-Yageo-datasheet-164759695.pdf?src-supplier=Future+Electronics; ComponentLink7Description: https://datasheet.octopart.com:443/RC0603FR-075K1L-Yageo-datasheet-164759695.pdf?src-supplier=Future+Electronics; ComponentLink8URL: https://datasheet.octopart.com:443/RC0603FR-075K1L-Yageo-datasheet-137700087.pdf?src-supplier=Future+Electronics; ComponentLink8Description: https://datasheet.octopart.com:443/RC0603FR-075K1L-Yageo-datasheet-137700087.pdf?src-supplier=Future+Electronics; ComponentLink9URL: https://datasheet.octopart.com:443/RC0603FR-075K1L-Yageo-datasheet-15599030.pdf?src-supplier=Future+Electronics; ComponentLink9Description: https://datasheet.octopart.com:443/RC0603FR-075K1L-Yageo-datasheet-15599030.pdf?src-supplier=Future+Electronics; ComponentLink10URL: https://datasheet.octopart.com:443/RC0603FR-075K1L-Yageo-datasheet-12596169.pdf?src-supplier=Future+Electronics; ComponentLink10Description: https://datasheet.octopart.com:443/RC0603FR-075K1L-Yageo-datasheet-12596169.pdf?src-supplier=Future+Electronics; ComponentLink11URL: https://datasheet.octopart.com:443/RC0603FR-075K1L-Yageo-datasheet-503470.pdf?src-supplier=Future+Electronics; ComponentLink11Description: https://datasheet.octopart.com:443/RC0603FR-075K1L-Yageo-datasheet-503470.pdf?src-supplier=Future+Electronics; ComponentLink12URL: https://datasheet.octopart.com:443/RC0603FR-075K1L-Yageo-datasheet-148775077.pdf?src-supplier=TME; ComponentLink12Description: https://datasheet.octopart.com:443/RC0603FR-075K1L-Yageo-datasheet-148775077.pdf?src-supplier=TME; ComponentLink13URL: https://datasheet.octopart.com:443/RC0603FR-075K1L-Yageo-datasheet-79472498.pdf?src-supplier=Megastar; ComponentLink13Description: https://datasheet.octopart.com:443/RC0603FR-075K1L-Yageo-datasheet-79472498.pdf?src-supplier=Megastar; ComponentLink14URL: https://datasheet.octopart.com/RC0603FR-075K1L-Yageo-datasheet-73766026.pdf; ComponentLink14Description: https://datasheet.octopart.com/RC0603FR-075K1L-Yageo-datasheet-73766026.pdf; ComponentLink15URL: https://datasheet.octopart.com:443/RC0603FR-075K1L-Yageo-datasheet-118562.pdf?src-supplier=DigiKey; ComponentLink15Description: https://datasheet.octopart.com:443/RC0603FR-075K1L-Yageo-datasheet-118562.pdf?src-supplier=DigiKey; ComponentLink16URL: http://sigma.octopart.com:80/conflict_mineral_statement/Yageo-company-3.pdf?src-supplier=Compliance+Statements; ComponentLink16Description: http://sigma.octopart.com:80/conflict_mineral_statement/Yageo-company-3.pdf?src-supplier=Compliance+Statements; ComponentLink17URL: http://sigma.octopart.com:80/rohs_statement/Yageo-company-2.pdf?src-supplier=Compliance+Statements; ComponentLink17Description: http://sigma.octopart.com:80/rohs_statement/Yageo-company-2.pdf?src-supplier=Compliance+Statements
R3 = RC0603JR-071K5L: 100Mw Thick Film Resistors 100Ppm/ 5% 1.5K 0603 Chip Resistor Surface Mount Rohs; Manufacturer: Yageo Group; Value: 1.5kΩ; Temperature Coefficient: 100ppm/°C; Voltage Rating: 75V; Voltage Rating (AC): 50V; Supplier: DigiKey; Supplier Part Number: 311-1.5KGRCT-ND; Manufacturer Part Number: RC0603JR-071K5L; RoHS: Compliant; Category: Chip SMD Resistors; Stock: 704185; Pricing: 1=0,1, 10=0,005, 25=0,0048 (USD); Case/Package: 0603; Case Code (Imperial): 0603; China RoHS: Non-Compliant; Composition: Thick Film; Depth: 800µm; Features: Moisture Resistant; Height: 450µm; Lead Free: Lead Free; Length: 1.6mm; Lifecycle Status: Production; Max Operating Temperature: 155°C; Max Power Dissipation: 100mW; Military Standard: Not; Min Operating Temperature: -55°C; Mounting Technology: Surface Mount; Pins: 2; Number of Terminals: 2; Number of Terminations: 2; Packaging: Tape & Reel; Power Dissipation: 100mW; Power Rating: 100mW; REACH SVHC: Yes; Schedule B: 8533210045, 8533210045|8533210045, 8533210045|8533210045|8533210045, 8533210045|8533210045|8533210045|8533210045; Termination: SMD/SMT; Tolerance: 5%; Voltage Rating (DC): 50V; Weight: 2.012816mg; Width: 800µm; Working Voltage: 75V; ComponentLink1URL: https://datasheet.octopart.com:443/RC0603JR-071K5L-Yageo-datasheet-175887523.pdf?src-supplier=Newark; ComponentLink1Description: https://datasheet.octopart.com:443/RC0603JR-071K5L-Yageo-datasheet-175887523.pdf?src-supplier=Newark; ComponentLink2URL: https://datasheet.octopart.com:443/RC0603JR-071K5L-Yageo-datasheet-8328172.pdf?src-supplier=Newark; ComponentLink2Description: https://datasheet.octopart.com:443/RC0603JR-071K5L-Yageo-datasheet-8328172.pdf?src-supplier=Newark; ComponentLink3URL: https://datasheet.octopart.com:443/RC0603JR-071K5L-Yageo-datasheet-62067350.pdf?src-supplier=element14+APAC; ComponentLink3Description: https://datasheet.octopart.com:443/RC0603JR-071K5L-Yageo-datasheet-62067350.pdf?src-supplier=element14+APAC; ComponentLink4URL: https://datasheet.octopart.com:443/RC0603JR-071K5L-Yageo-datasheet-34211833.pdf?src-supplier=element14+APAC; ComponentLink4Description: https://datasheet.octopart.com:443/RC0603JR-071K5L-Yageo-datasheet-34211833.pdf?src-supplier=element14+APAC; ComponentLink5URL: https://datasheet.octopart.com:443/RC0603JR-071K5L-Yageo-Group-datasheet-176638170.pdf?src-supplier=Farnell; ComponentLink5Description: https://datasheet.octopart.com:443/RC0603JR-071K5L-Yageo-Group-datasheet-176638170.pdf?src-supplier=Farnell; ComponentLink6URL: https://datasheet.octopart.com:443/RC0603JR-071K5L-Yageo-datasheet-164759695.pdf?src-supplier=Future+Electronics; ComponentLink6Description: https://datasheet.octopart.com:443/RC0603JR-071K5L-Yageo-datasheet-164759695.pdf?src-supplier=Future+Electronics; ComponentLink7URL: https://datasheet.octopart.com:443/RC0603JR-071K5L-Yageo-datasheet-137700087.pdf?src-supplier=Future+Electronics; ComponentLink7Description: https://datasheet.octopart.com:443/RC0603JR-071K5L-Yageo-datasheet-137700087.pdf?src-supplier=Future+Electronics; ComponentLink8URL: https://datasheet.octopart.com:443/RC0603JR-071K5L-Yageo-datasheet-27584510.pdf?src-supplier=Future+Electronics; ComponentLink8Description: https://datasheet.octopart.com:443/RC0603JR-071K5L-Yageo-datasheet-27584510.pdf?src-supplier=Future+Electronics; ComponentLink9URL: https://datasheet.octopart.com:443/RC0603JR-071K5L-Yageo-datasheet-15599030.pdf?src-supplier=Future+Electronics; ComponentLink9Description: https://datasheet.octopart.com:443/RC0603JR-071K5L-Yageo-datasheet-15599030.pdf?src-supplier=Future+Electronics; ComponentLink10URL: https://datasheet.octopart.com:443/RC0603JR-071K5L-Yageo-datasheet-12596169.pdf?src-supplier=Future+Electronics; ComponentLink10Description: https://datasheet.octopart.com:443/RC0603JR-071K5L-Yageo-datasheet-12596169.pdf?src-supplier=Future+Electronics; ComponentLink11URL: https://datasheet.octopart.com:443/RC0603JR-071K5L-Yageo-datasheet-8324193.pdf?src-supplier=Future+Electronics; ComponentLink11Description: https://datasheet.octopart.com:443/RC0603JR-071K5L-Yageo-datasheet-8324193.pdf?src-supplier=Future+Electronics; ComponentLink12URL: https://datasheet.octopart.com:443/RC0603JR-071K5L-Yageo-datasheet-79472498.pdf?src-supplier=Megastar; ComponentLink12Description: https://datasheet.octopart.com:443/RC0603JR-071K5L-Yageo-datasheet-79472498.pdf?src-supplier=Megastar; ComponentLink13URL: https://datasheet.octopart.com/RC0603JR-071K5L-Yageo-datasheet-73766026.pdf; ComponentLink13Description: https://datasheet.octopart.com/RC0603JR-071K5L-Yageo-datasheet-73766026.pdf; ComponentLink14URL: https://datasheet.octopart.com:443/RC0603JR-071K5L-Yageo-datasheet-118562.pdf?src-supplier=DigiKey; ComponentLink14Description: https://datasheet.octopart.com:443/RC0603JR-071K5L-Yageo-datasheet-118562.pdf?src-supplier=DigiKey; ComponentLink15URL: http://sigma.octopart.com:80/conflict_mineral_statement/Yageo-company-3.pdf?src-supplier=Compliance+Statements; ComponentLink15Description: http://sigma.octopart.com:80/conflict_mineral_statement/Yageo-company-3.pdf?src-supplier=Compliance+Statements; ComponentLink16URL: http://sigma.octopart.com:80/rohs_statement/Yageo-company-2.pdf?src-supplier=Compliance+Statements; ComponentLink16Description: http://sigma.octopart.com:80/rohs_statement/Yageo-company-2.pdf?src-supplier=Compliance+Statements